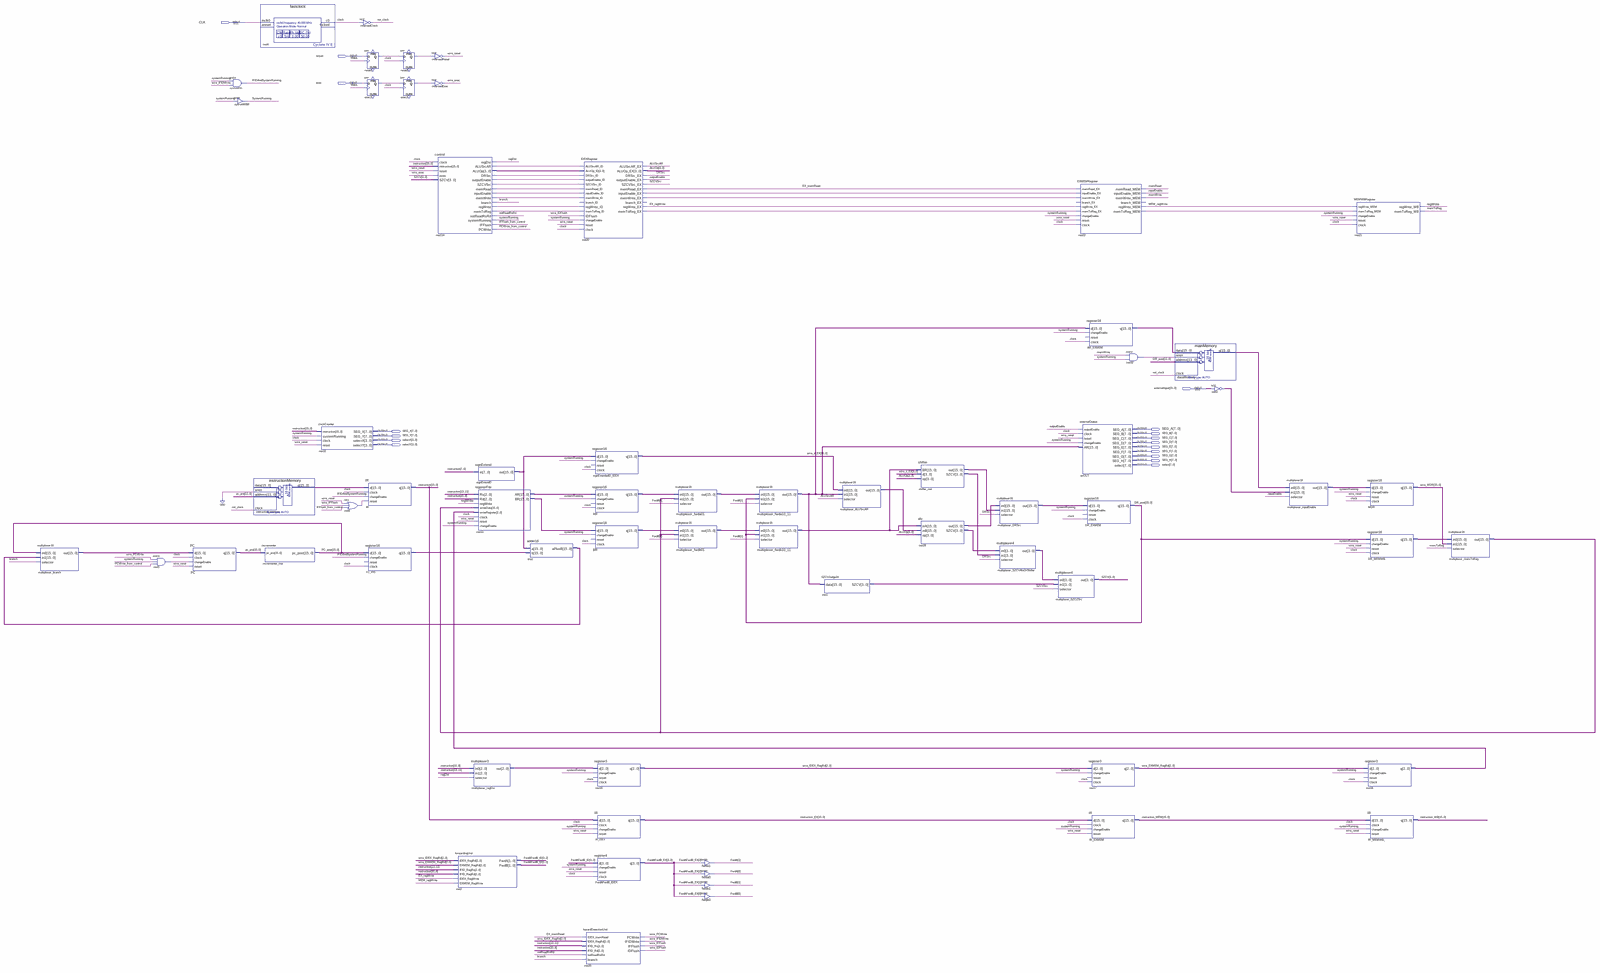
[diagram p0: schematic sheet, whole]
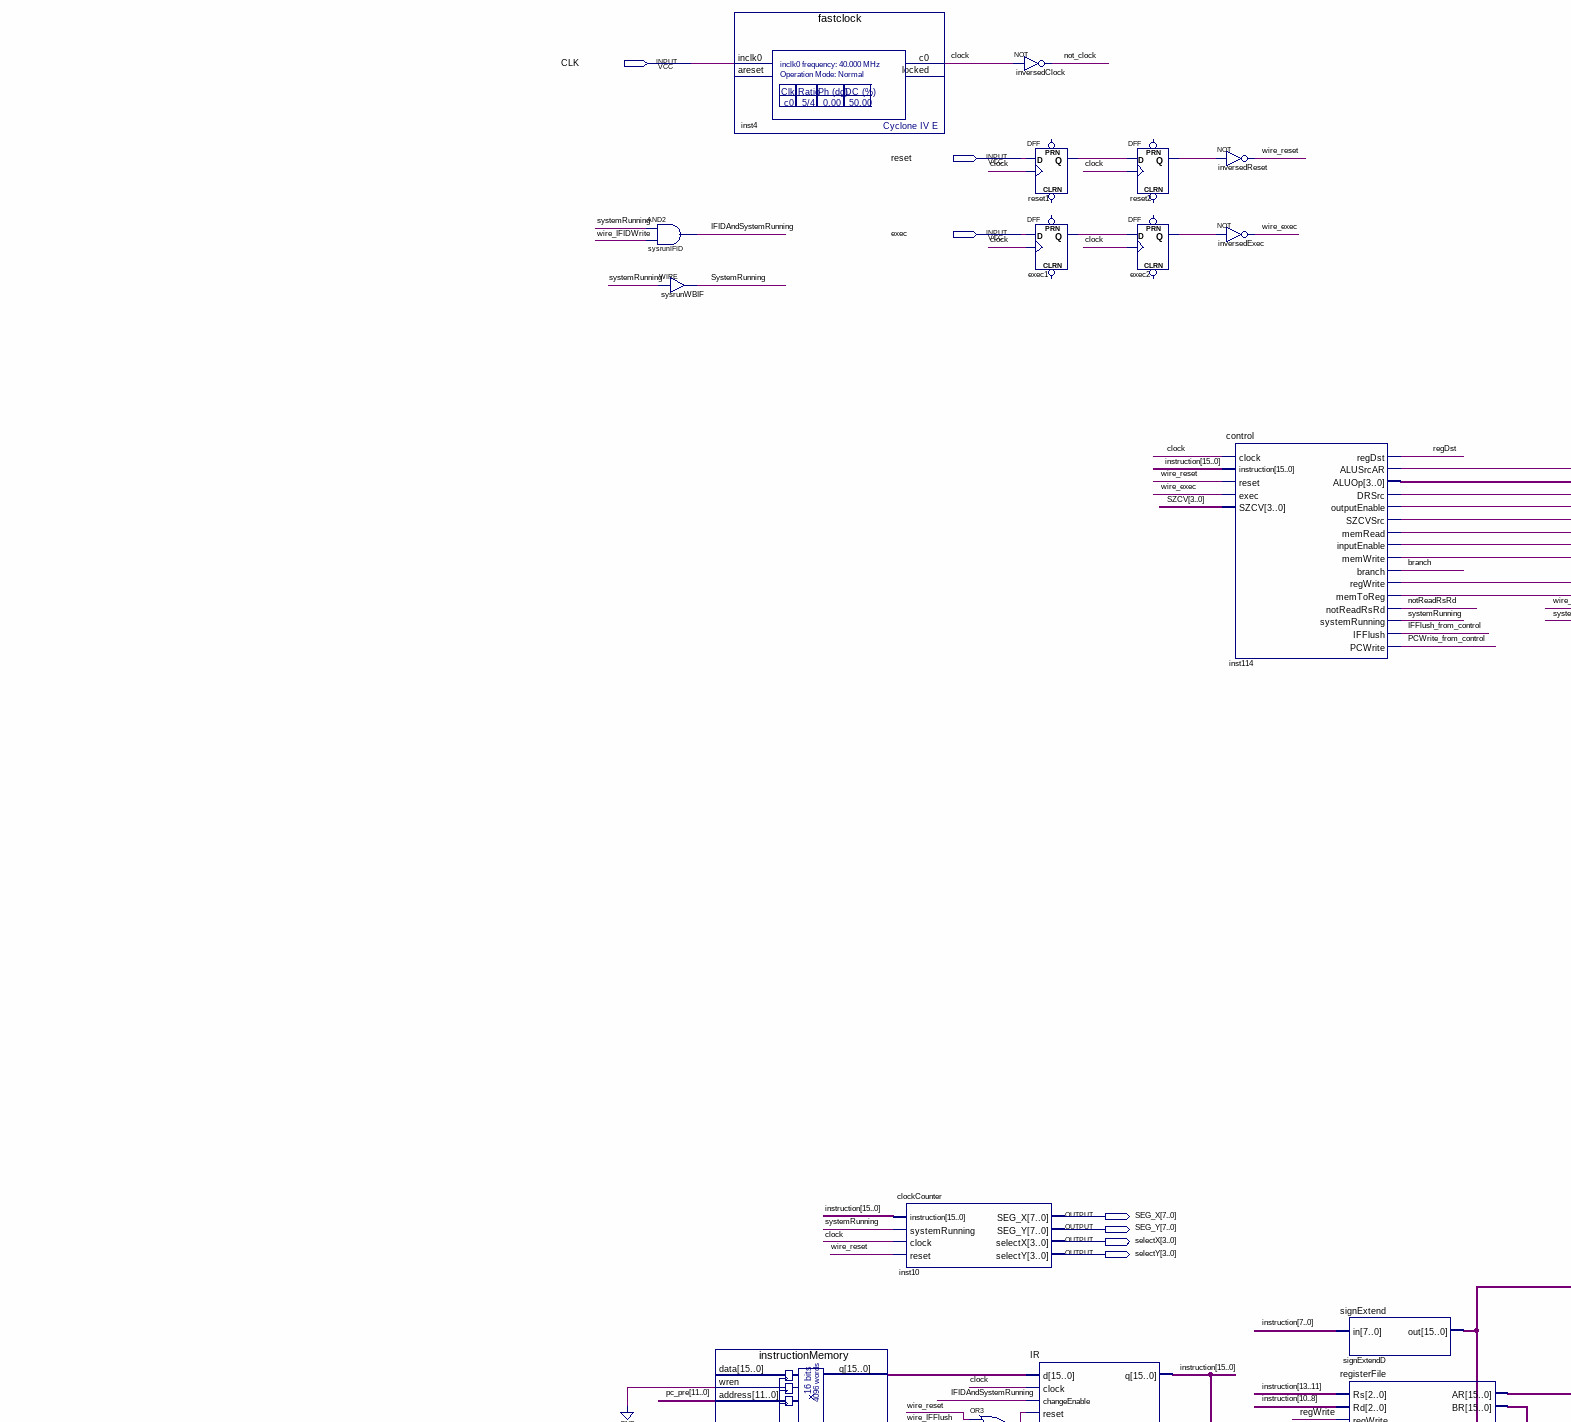
[diagram p1: schematic sheet, upper left part]
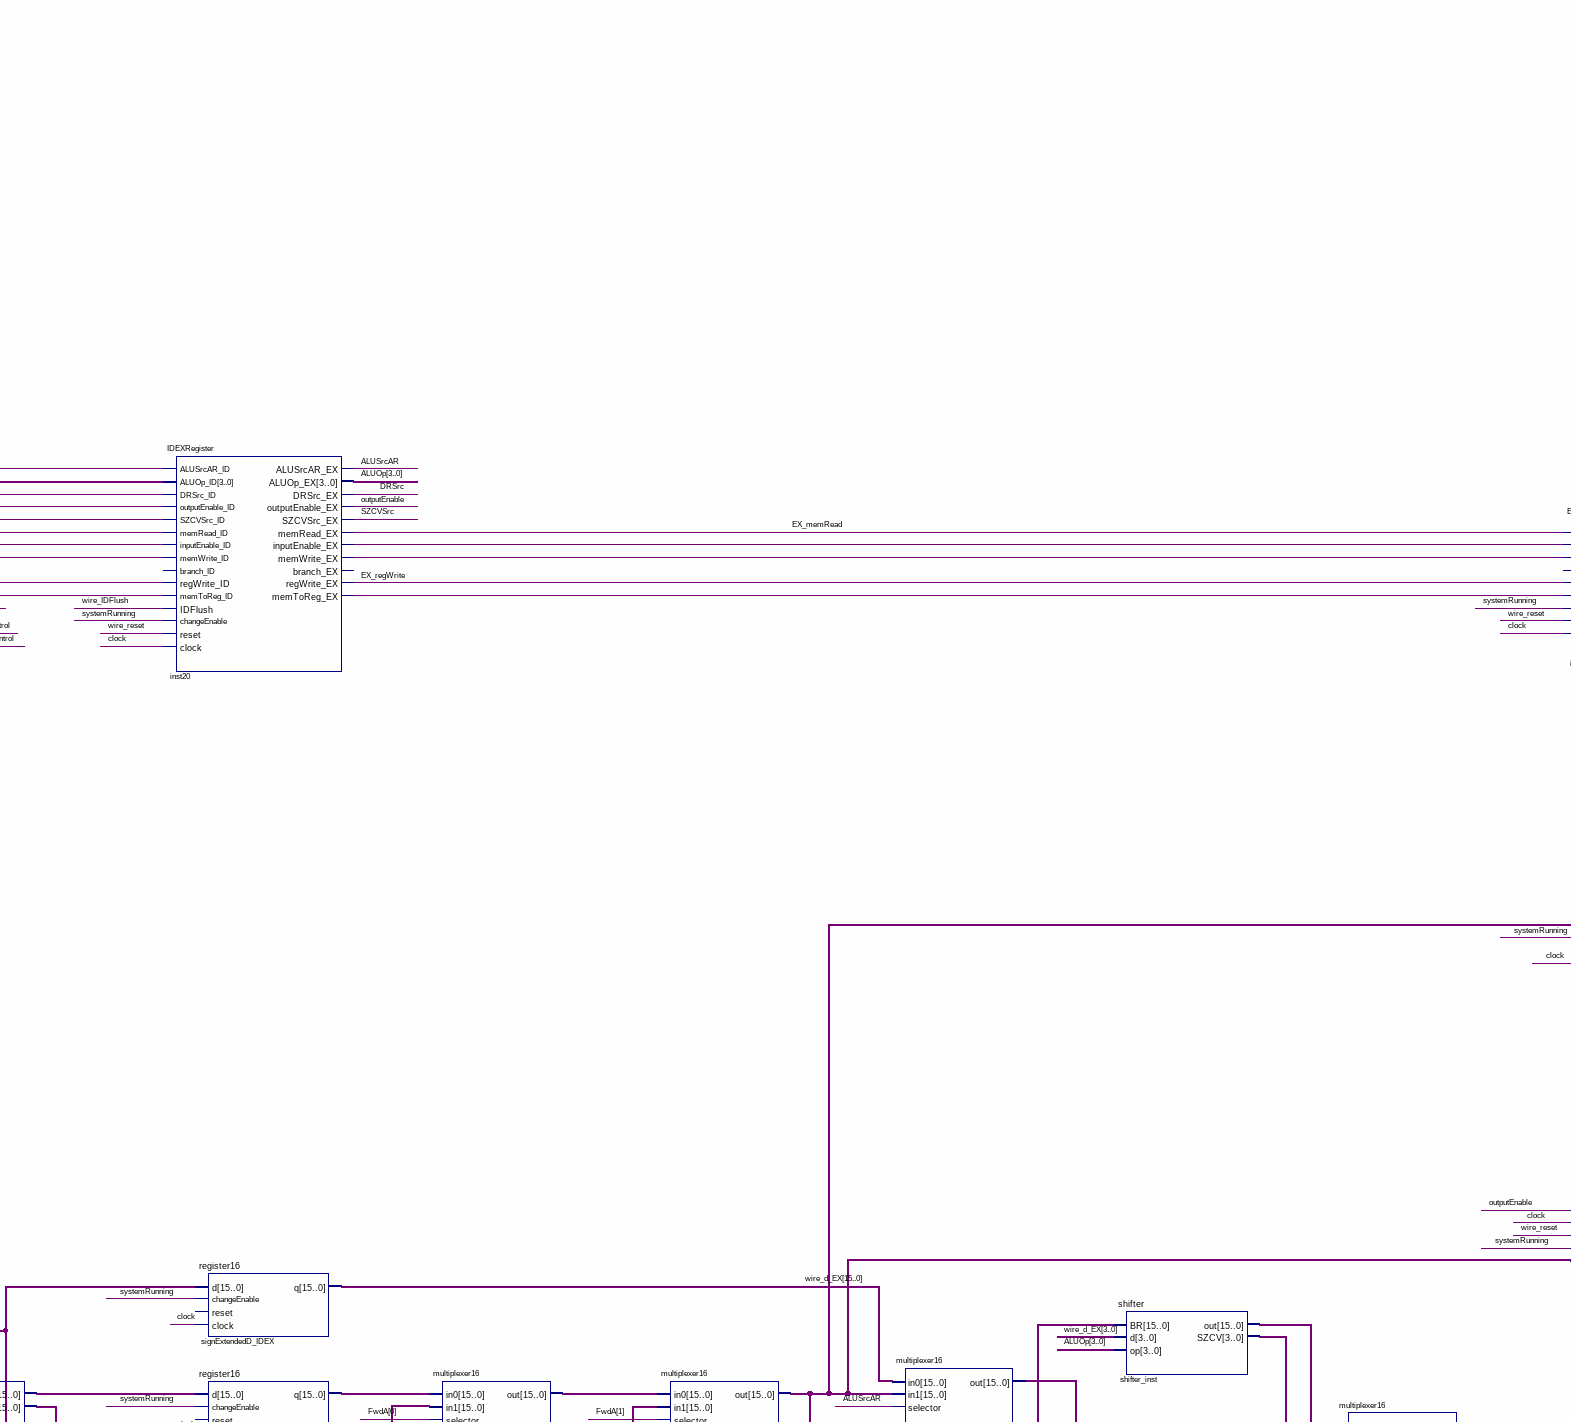
[diagram p2: schematic sheet, upper centre part]
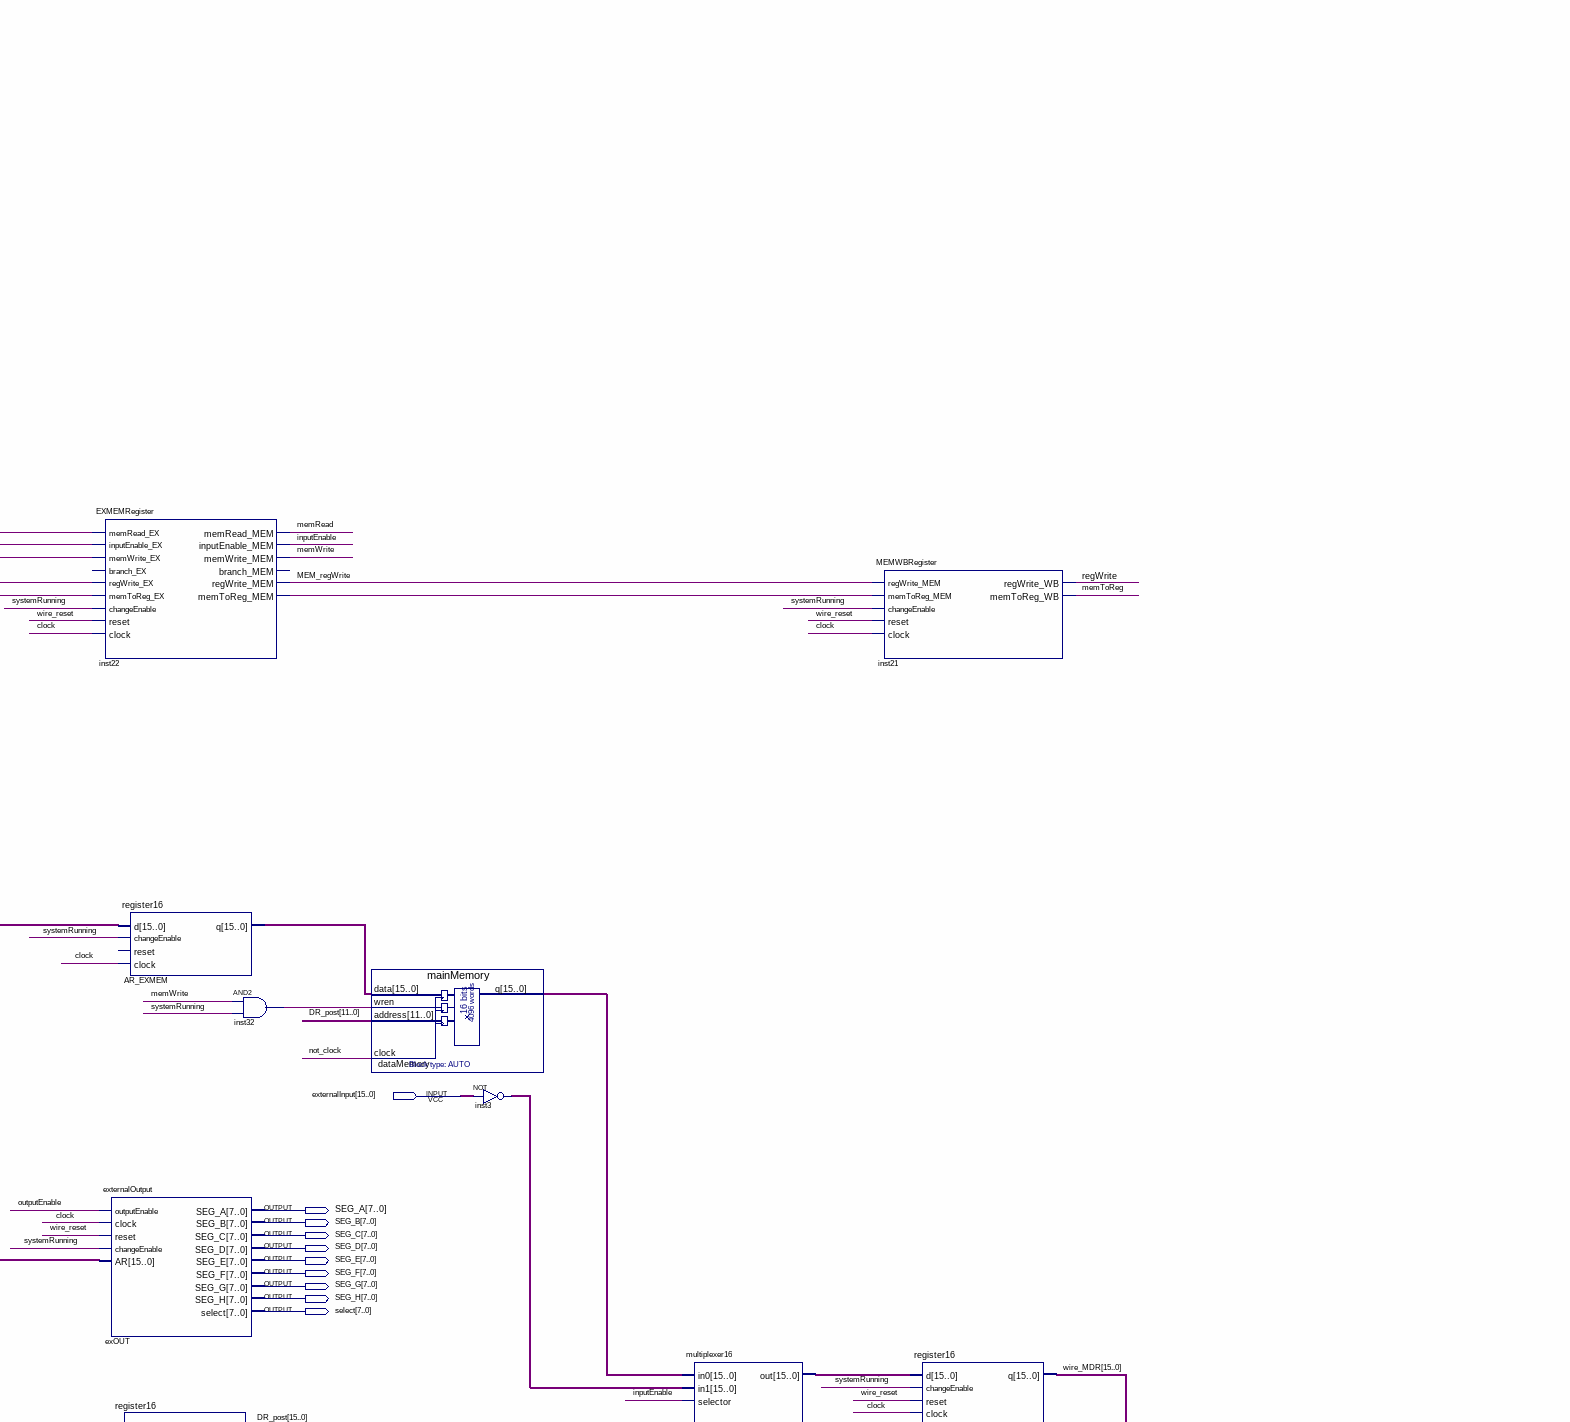
[diagram p3: schematic sheet, upper right part]
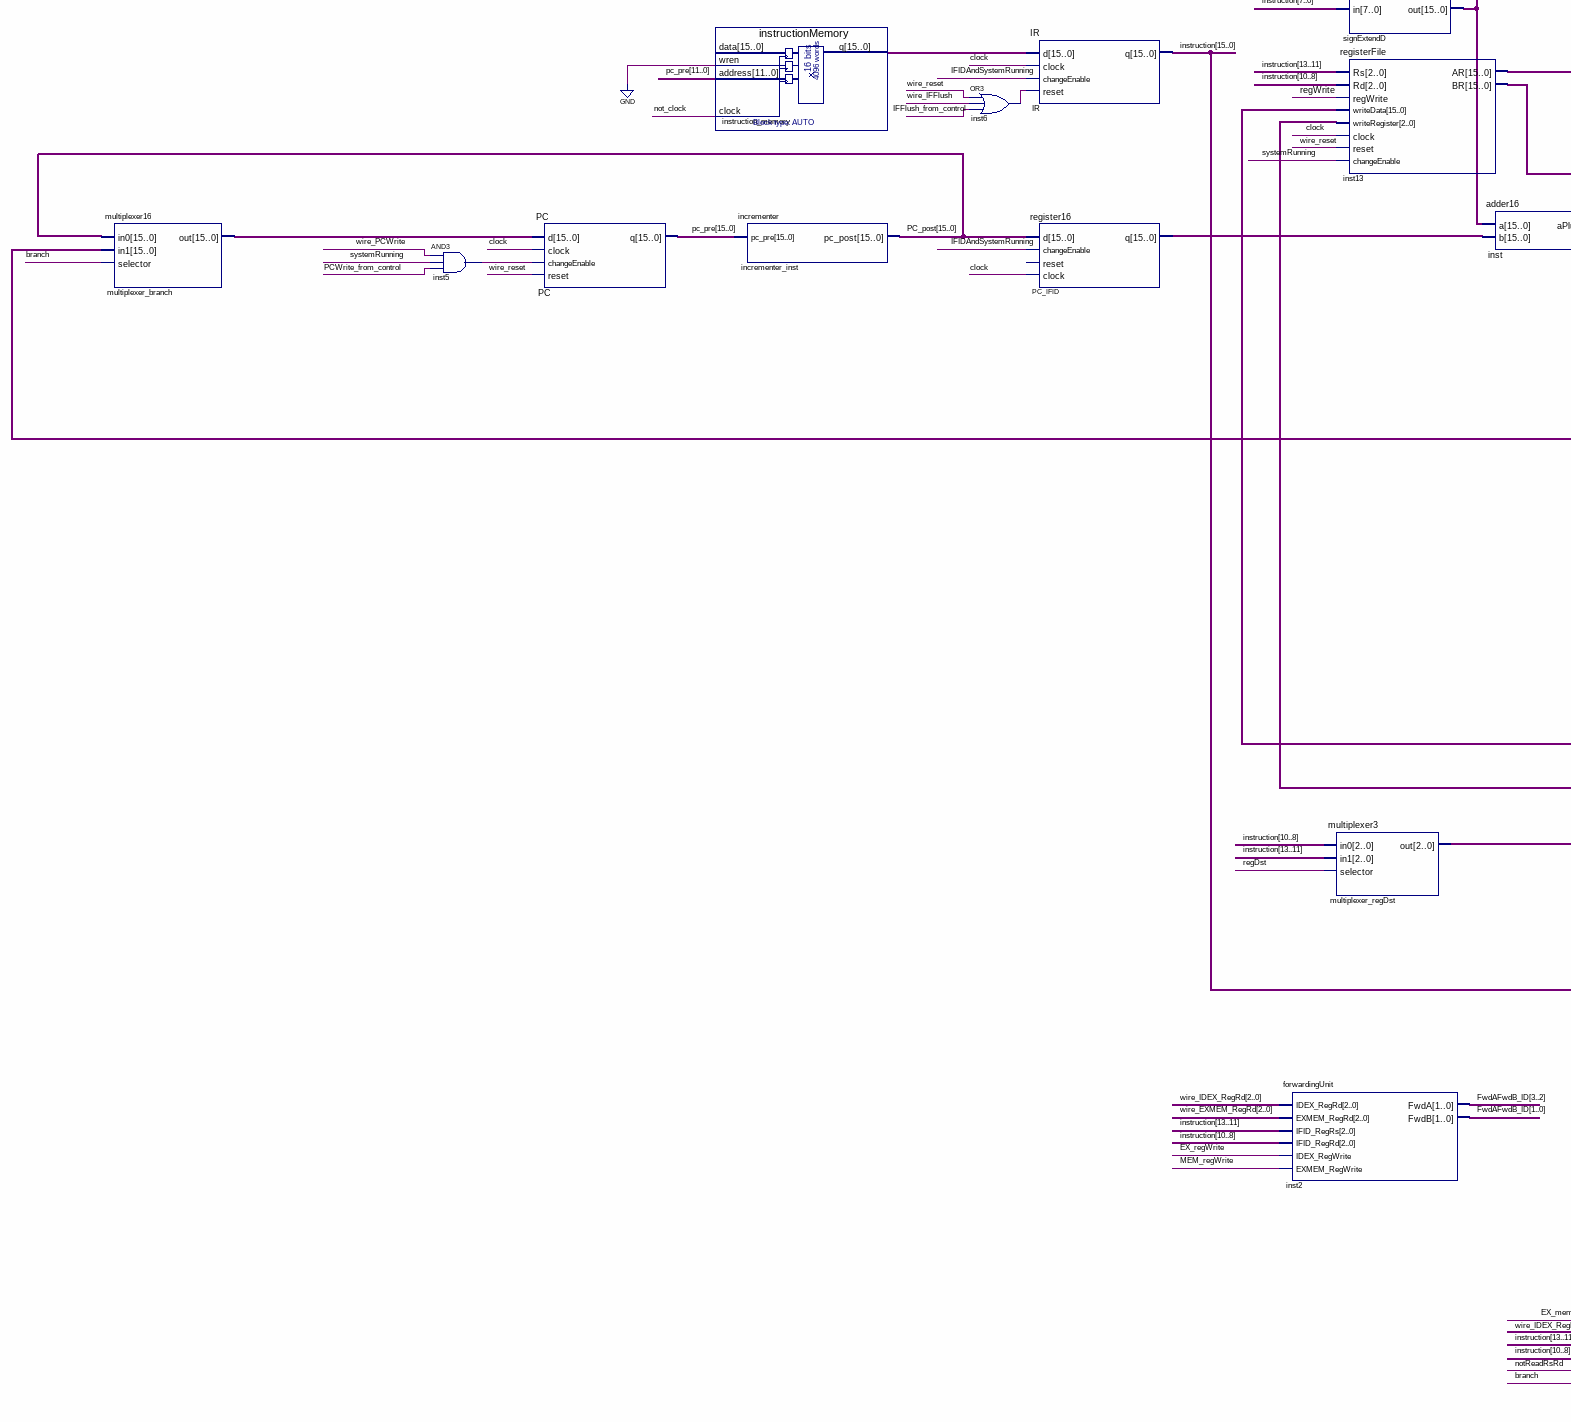
[diagram p4: schematic sheet, lower left part]
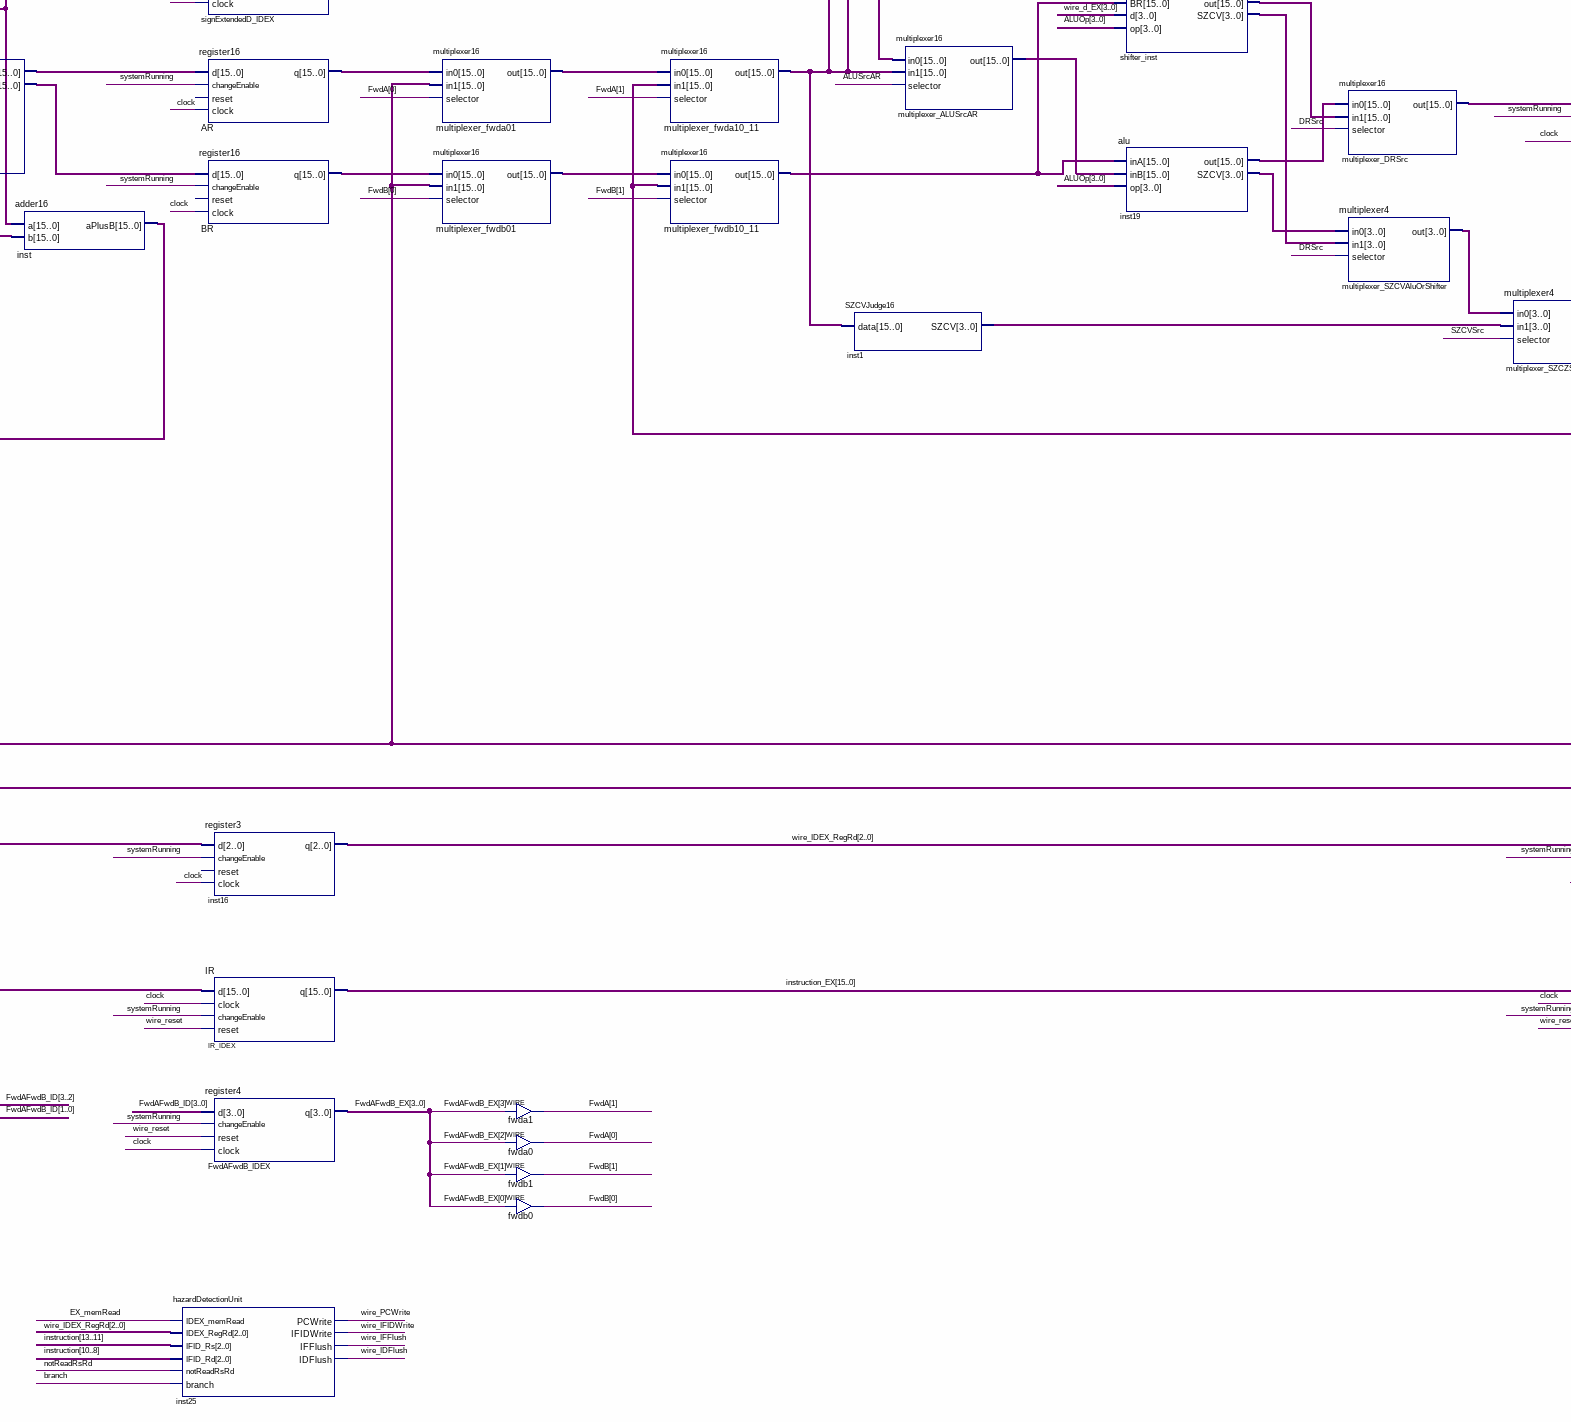
[diagram p5: schematic sheet, lower centre part]
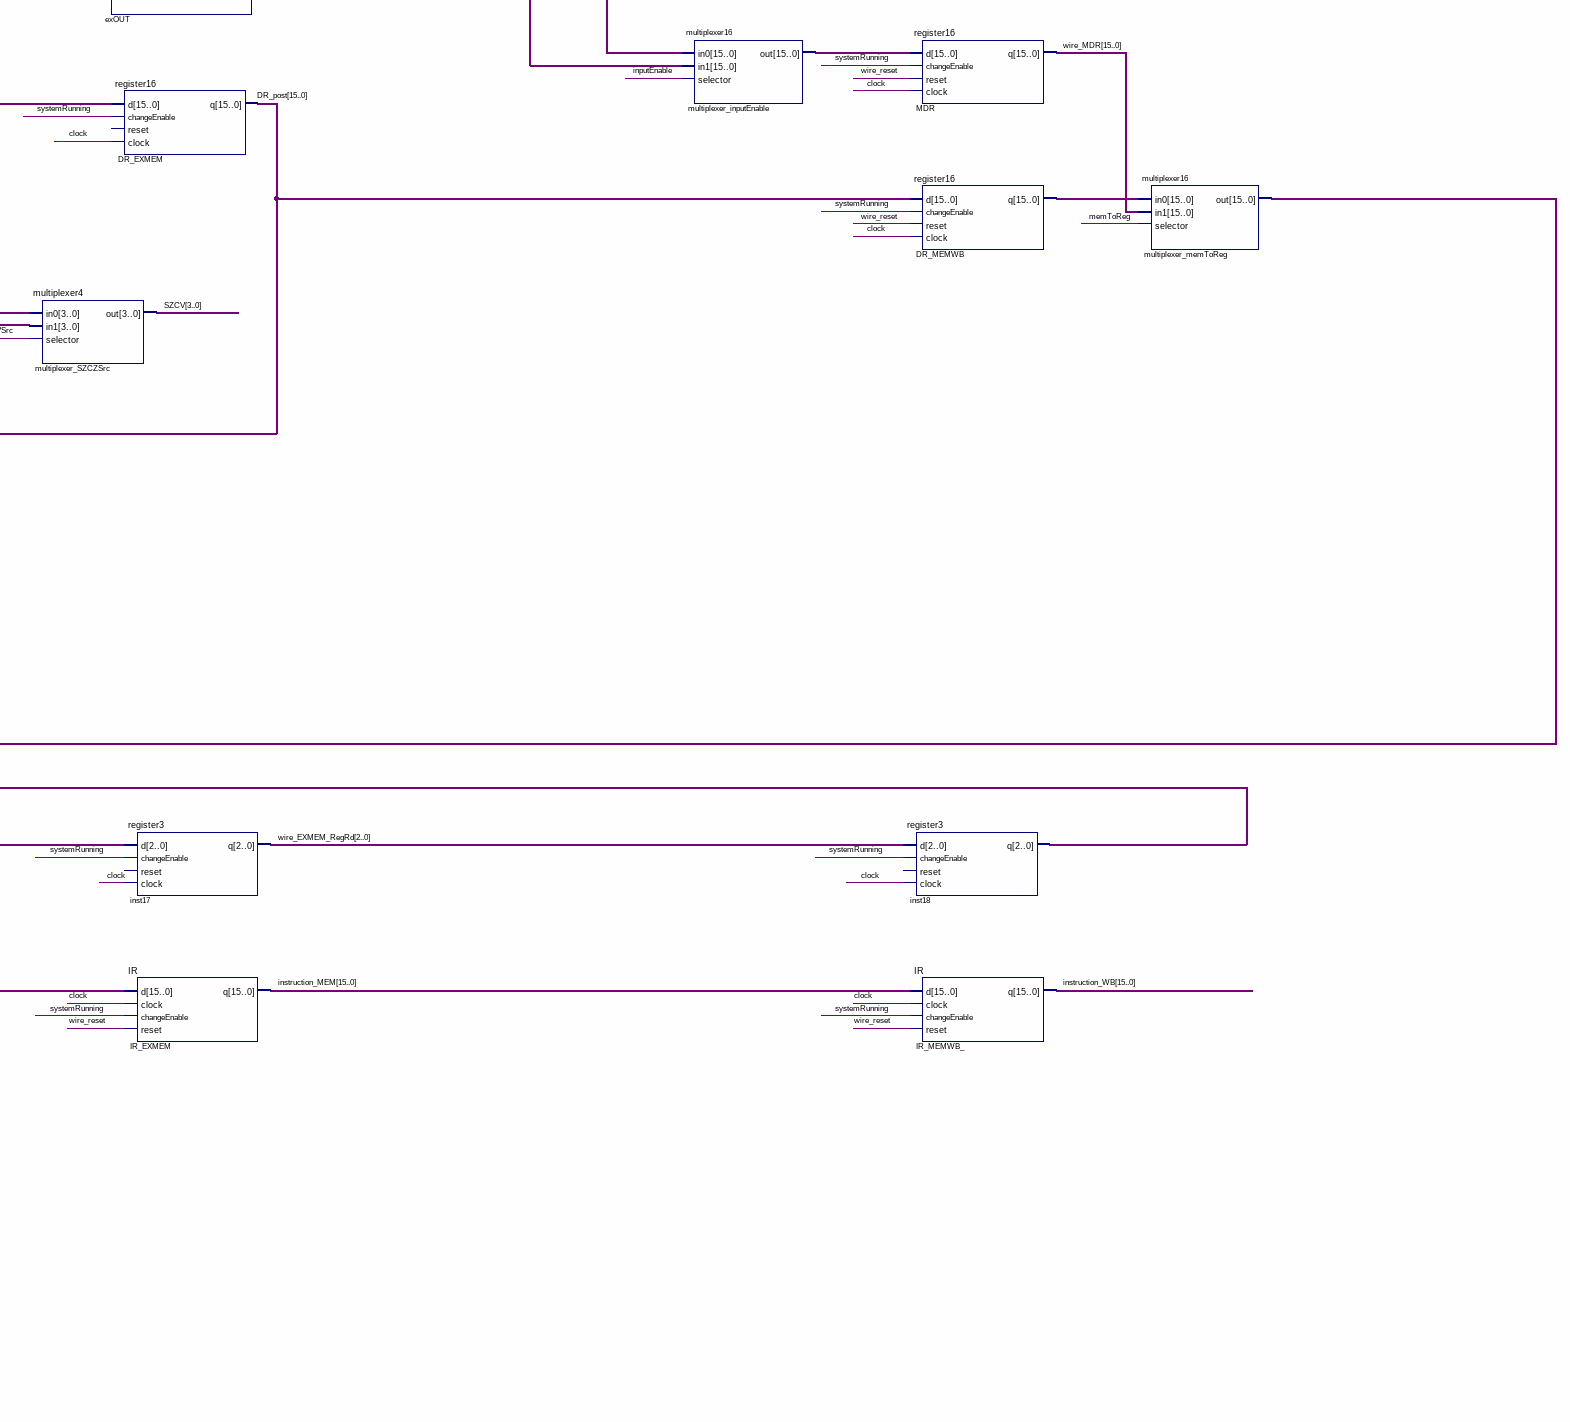
[diagram p6: schematic sheet, lower right part]
// Quartus schematic processor.bdf as structural Verilog: 64 symbols, 17 pins
module processor (
  input  CLK,
  input  reset,
  input  exec,
  input  [15:0] externalInput,
  output [7:0] SEG_A,
  output [7:0] SEG_X,
  output [7:0] SEG_B,
  output [7:0] SEG_Y,
  output [7:0] SEG_C,
  output [3:0] selectX,
  output [7:0] SEG_D,
  output [3:0] selectY,
  output [7:0] SEG_E,
  output [7:0] SEG_F,
  output [7:0] SEG_G,
  output [7:0] SEG_H,
  output [7:0] select
);

  wire ALUSrcAR, branch, clock, DRSrc, EX_memRead, EX_regWrite, exec1_q, exec2_q, IFFlush_from_control,
       IFIDAndSystemRunning, inputEnable, inst5_out, inst6_out, inst20_inputenable_ex, inst20_memtoreg_ex,
       inst20_memwrite_ex, inst22_memtoreg_mem, inst32_out, inst114_alusrcar, inst114_drsrc,
       inst114_inputenable, inst114_memread, inst114_memtoreg, inst114_memwrite, inst114_outputenable,
       inst114_regwrite, inst114_szcvsrc, MEM_regWrite, memRead, memToReg, memWrite, not_clock, notReadRsRd,
       outputEnable, PCWrite_from_control, regDst, regWrite, reset1_q, reset2_q, systemRunning, SZCVSrc,
       wire_exec, wire_IDFlush, wire_IFFlush, wire_IFIDWrite, wire_PCWrite, wire_reset;
  wire [1:0] FwdA, FwdB;
  wire [2:0] inst18_q, multiplexer_regDst_out, wire_EXMEM_RegRd, wire_IDEX_RegRd;
  wire [3:0] ALUOp, FwdAFwdB_EX, FwdAFwdB_ID, inst1_szcv, inst19_szcv, inst114_aluop,
       multiplexer_SZCVAluOrShifter_out, shifter_inst_szcv, SZCV;
  wire [15:0] AR_EXMEM_q, AR_q, BR_q, dataMemory_q, DR_MEMWB_q, DR_post, inst3_out, inst13_ar, inst13_br,
       inst19_out, inst_aplusb, instruction, instruction_EX, instruction_MEM, instruction_memory_q,
       instruction_WB, multiplexer_ALUSrcAR_out, multiplexer_branch_out, multiplexer_DRSrc_out,
       multiplexer_fwda01_out, multiplexer_fwda10_11_out, multiplexer_fwdb01_out, multiplexer_fwdb10_11_out,
       multiplexer_inputEnable_out, multiplexer_memToReg_out, PC_IFID_q, PC_post, pc_pre, shifter_inst_out,
       signExtendD_out, wire_d_EX, wire_MDR;

  multiplexer16 multiplexer_branch (.in0(PC_post), .in1(inst_aplusb), .selector(branch), .out(multiplexer_branch_out));
  and inst5 (inst5_out, wire_PCWrite, systemRunning, PCWrite_from_control);
  PC PC (.d(multiplexer_branch_out), .clock(clock), .changeEnable(inst5_out), .reset(wire_reset), .q(pc_pre));
  and sysrunIFID (IFIDAndSystemRunning, systemRunning, wire_IFIDWrite);
  assign systemRunning = systemRunning;  // WIRE sysrunWBIF
  instructionMemory instruction_memory (
    .wren(1'b0), .address(pc_pre[11:0]), .clock(not_clock), .q(instruction_memory_q));  // open: data
  fastclock inst4 (.inclk0(CLK), .c0(clock));  // open: areset, locked
  incrementer incrementer_inst (.pc_pre(pc_pre), .pc_post(PC_post));
  clockCounter inst10 (
    .instruction(instruction), .systemRunning(systemRunning), .clock(clock), .reset(wire_reset),
    .SEG_X(SEG_X), .SEG_Y(SEG_Y), .selectX(selectX), .selectY(selectY));
  or inst6 (inst6_out, wire_reset, wire_IFFlush, IFFlush_from_control);
  not inversedClock (not_clock, clock);
  DFF reset1 (.CLK(clock), .D(reset), .Q(reset1_q));  // open: CLRN, PRN
  DFF exec1 (.CLK(clock), .D(exec), .Q(exec1_q));  // open: CLRN, PRN
  IR IR (
    .d(instruction_memory_q), .clock(clock), .changeEnable(IFIDAndSystemRunning), .reset(inst6_out),
    .q(instruction));
  register16 PC_IFID (.d(PC_post), .changeEnable(IFIDAndSystemRunning), .clock(clock), .q(PC_IFID_q));  // open: reset
  DFF reset2 (.CLK(clock), .D(reset1_q), .Q(reset2_q));  // open: CLRN, PRN
  DFF exec2 (.CLK(clock), .D(exec1_q), .Q(exec2_q));  // open: CLRN, PRN
  not inversedReset (wire_reset, reset2_q);
  not inversedExec (wire_exec, exec2_q);
  control inst114 (
    .clock(clock), .instruction(instruction), .reset(wire_reset), .exec(wire_exec), .SZCV(SZCV),
    .regDst(regDst), .ALUSrcAR(inst114_alusrcar), .ALUOp(inst114_aluop), .DRSrc(inst114_drsrc),
    .outputEnable(inst114_outputenable), .SZCVSrc(inst114_szcvsrc), .memRead(inst114_memread),
    .inputEnable(inst114_inputenable), .memWrite(inst114_memwrite), .branch(branch),
    .regWrite(inst114_regwrite), .memToReg(inst114_memtoreg), .notReadRsRd(notReadRsRd),
    .systemRunning(systemRunning), .IFFlush(IFFlush_from_control), .PCWrite(PCWrite_from_control));
  multiplexer3 multiplexer_regDst (
    .in0(instruction[10:8]), .in1(instruction[13:11]), .selector(regDst), .out(multiplexer_regDst_out));
  forwardingUnit inst2 (
    .IDEX_RegRd(wire_IDEX_RegRd), .EXMEM_RegRd(wire_EXMEM_RegRd), .IFID_RegRs(instruction[13:11]),
    .IFID_RegRd(instruction[10:8]), .IDEX_RegWrite(EX_regWrite), .EXMEM_RegWrite(MEM_regWrite),
    .FwdA(FwdAFwdB_ID[3:2]), .FwdB(FwdAFwdB_ID[1:0]));
  signExtend signExtendD (.in(instruction[7:0]), .out(signExtendD_out));
  registerFile inst13 (
    .Rs(instruction[13:11]), .Rd(instruction[10:8]), .regWrite(regWrite),
    .writeData(multiplexer_memToReg_out), .writeRegister(inst18_q), .clock(clock), .reset(wire_reset),
    .changeEnable(systemRunning), .AR(inst13_ar), .BR(inst13_br));
  adder16 inst (.a(signExtendD_out), .b(PC_IFID_q), .aPlusB(inst_aplusb));
  IDEXRegister inst20 (
    .ALUSrcAR_ID(inst114_alusrcar), .ALUOp_ID(inst114_aluop), .DRSrc_ID(inst114_drsrc),
    .outputEnable_ID(inst114_outputenable), .SZCVSrc_ID(inst114_szcvsrc), .memRead_ID(inst114_memread),
    .inputEnable_ID(inst114_inputenable), .memWrite_ID(inst114_memwrite), .regWrite_ID(inst114_regwrite),
    .memToReg_ID(inst114_memtoreg), .IDFlush(wire_IDFlush), .changeEnable(systemRunning), .reset(wire_reset),
    .clock(clock), .ALUSrcAR_EX(ALUSrcAR), .ALUOp_EX(ALUOp), .DRSrc_EX(DRSrc),
    .outputEnable_EX(outputEnable), .SZCVSrc_EX(SZCVSrc), .memRead_EX(EX_memRead),
    .inputEnable_EX(inst20_inputenable_ex), .memWrite_EX(inst20_memwrite_ex), .regWrite_EX(EX_regWrite),
    .memToReg_EX(inst20_memtoreg_ex));  // open: branch_ID, branch_EX
  register16 signExtendedD_IDEX (
    .d(signExtendD_out), .changeEnable(systemRunning), .clock(clock), .q(wire_d_EX));  // open: reset
  register16 AR (.d(inst13_ar), .changeEnable(systemRunning), .clock(clock), .q(AR_q));  // open: reset
  register16 BR (.d(inst13_br), .changeEnable(systemRunning), .clock(clock), .q(BR_q));  // open: reset
  register3 inst16 (
    .d(multiplexer_regDst_out), .changeEnable(systemRunning), .clock(clock), .q(wire_IDEX_RegRd));  // open: reset
  IR IR_IDEX (.d(instruction), .clock(clock), .changeEnable(systemRunning), .reset(wire_reset), .q(instruction_EX));
  register4 FwdAFwdB_IDEX (
    .d(FwdAFwdB_ID), .changeEnable(systemRunning), .reset(wire_reset), .clock(clock), .q(FwdAFwdB_EX));
  hazardDetectionUnit inst25 (
    .IDEX_memRead(EX_memRead), .IDEX_RegRd(wire_IDEX_RegRd), .IFID_Rs(instruction[13:11]),
    .IFID_Rd(instruction[10:8]), .notReadRsRd(notReadRsRd), .branch(branch), .PCWrite(wire_PCWrite),
    .IFIDWrite(wire_IFIDWrite), .IFFlush(wire_IFFlush), .IDFlush(wire_IDFlush));
  multiplexer16 multiplexer_fwda01 (
    .in0(AR_q), .in1(multiplexer_memToReg_out), .selector(FwdA[0]), .out(multiplexer_fwda01_out));
  multiplexer16 multiplexer_fwdb01 (
    .in0(BR_q), .in1(multiplexer_memToReg_out), .selector(FwdB[0]), .out(multiplexer_fwdb01_out));
  assign FwdA[1] = FwdAFwdB_EX[3];  // WIRE fwda1
  assign FwdA[0] = FwdAFwdB_EX[2];  // WIRE fwda0
  assign FwdB[1] = FwdAFwdB_EX[1];  // WIRE fwdb1
  assign FwdB[0] = FwdAFwdB_EX[0];  // WIRE fwdb0
  multiplexer16 multiplexer_fwda10_11 (
    .in0(multiplexer_fwda01_out), .in1(DR_post), .selector(FwdA[1]), .out(multiplexer_fwda10_11_out));
  multiplexer16 multiplexer_fwdb10_11 (
    .in0(multiplexer_fwdb01_out), .in1(DR_post), .selector(FwdB[1]), .out(multiplexer_fwdb10_11_out));
  SZCVJudge16 inst1 (.data(multiplexer_fwda10_11_out), .SZCV(inst1_szcv));
  multiplexer16 multiplexer_ALUSrcAR (
    .in0(wire_d_EX), .in1(multiplexer_fwda10_11_out), .selector(ALUSrcAR), .out(multiplexer_ALUSrcAR_out));
  shifter shifter_inst (
    .BR(multiplexer_fwdb10_11_out), .d(wire_d_EX[3:0]), .op(ALUOp), .out(shifter_inst_out),
    .SZCV(shifter_inst_szcv));
  alu inst19 (
    .inA(multiplexer_fwdb10_11_out), .inB(multiplexer_ALUSrcAR_out), .op(ALUOp), .out(inst19_out),
    .SZCV(inst19_szcv));
  multiplexer16 multiplexer_DRSrc (
    .in0(inst19_out), .in1(shifter_inst_out), .selector(DRSrc), .out(multiplexer_DRSrc_out));
  multiplexer4 multiplexer_SZCVAluOrShifter (
    .in0(inst19_szcv), .in1(shifter_inst_szcv), .selector(DRSrc), .out(multiplexer_SZCVAluOrShifter_out));
  multiplexer4 multiplexer_SZCZSrc (
    .in0(multiplexer_SZCVAluOrShifter_out), .in1(inst1_szcv), .selector(SZCVSrc), .out(SZCV));
  EXMEMRegister inst22 (
    .memRead_EX(EX_memRead), .inputEnable_EX(inst20_inputenable_ex), .memWrite_EX(inst20_memwrite_ex),
    .regWrite_EX(EX_regWrite), .memToReg_EX(inst20_memtoreg_ex), .changeEnable(systemRunning),
    .reset(wire_reset), .clock(clock), .memRead_MEM(memRead), .inputEnable_MEM(inputEnable),
    .memWrite_MEM(memWrite), .regWrite_MEM(MEM_regWrite), .memToReg_MEM(inst22_memtoreg_mem));  // open: branch_EX, branch_MEM
  externalOutput exOUT (
    .outputEnable(outputEnable), .clock(clock), .reset(wire_reset), .changeEnable(systemRunning),
    .AR(multiplexer_fwda10_11_out), .SEG_A(SEG_A), .SEG_B(SEG_B), .SEG_C(SEG_C), .SEG_D(SEG_D),
    .SEG_E(SEG_E), .SEG_F(SEG_F), .SEG_G(SEG_G), .SEG_H(SEG_H), .select(select));
  register16 AR_EXMEM (
    .d(multiplexer_fwda10_11_out), .changeEnable(systemRunning), .clock(clock), .q(AR_EXMEM_q));  // open: reset
  register16 DR_EXMEM (
    .d(multiplexer_DRSrc_out), .changeEnable(systemRunning), .clock(clock), .q(DR_post));  // open: reset
  register3 inst17 (
    .d(wire_IDEX_RegRd), .changeEnable(systemRunning), .clock(clock), .q(wire_EXMEM_RegRd));  // open: reset
  IR IR_EXMEM (
    .d(instruction_EX), .clock(clock), .changeEnable(systemRunning), .reset(wire_reset), .q(instruction_MEM));
  and inst32 (inst32_out, memWrite, systemRunning);
  mainMemory dataMemory (
    .data(AR_EXMEM_q), .wren(inst32_out), .address(DR_post[11:0]), .clock(not_clock), .q(dataMemory_q));
  assign inst3_out = ~externalInput;  // NOT inst3, 16 bits wide
  multiplexer16 multiplexer_inputEnable (
    .in0(dataMemory_q), .in1(inst3_out), .selector(inputEnable), .out(multiplexer_inputEnable_out));
  MEMWBRegister inst21 (
    .regWrite_MEM(MEM_regWrite), .memToReg_MEM(inst22_memtoreg_mem), .changeEnable(systemRunning),
    .reset(wire_reset), .clock(clock), .regWrite_WB(regWrite), .memToReg_WB(memToReg));
  register16 MDR (
    .d(multiplexer_inputEnable_out), .changeEnable(systemRunning), .reset(wire_reset), .clock(clock),
    .q(wire_MDR));
  register16 DR_MEMWB (.d(DR_post), .changeEnable(systemRunning), .reset(wire_reset), .clock(clock), .q(DR_MEMWB_q));
  register3 inst18 (.d(wire_EXMEM_RegRd), .changeEnable(systemRunning), .clock(clock), .q(inst18_q));  // open: reset
  IR IR_MEMWB_ (
    .d(instruction_MEM), .clock(clock), .changeEnable(systemRunning), .reset(wire_reset), .q(instruction_WB));
  multiplexer16 multiplexer_memToReg (
    .in0(DR_MEMWB_q), .in1(wire_MDR), .selector(memToReg), .out(multiplexer_memToReg_out));
endmodule
